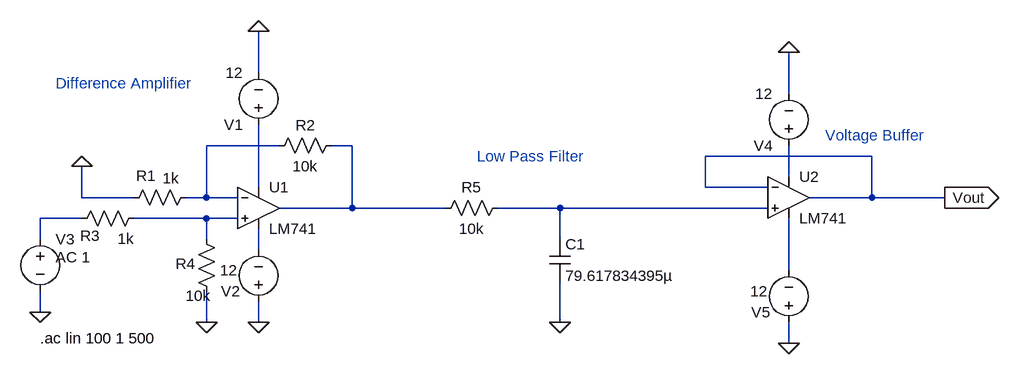
[diagram p0: schematic p3.asc]
p3.asc, the LTspice schematic file:
Version 4
SHEET 1 1376 680
WIRE 208 -32 208 -96
WIRE 1024 0 1024 -64
WIRE 240 80 128 80
WIRE 352 80 320 80
WIRE 1152 96 896 96
WIRE 1024 128 1024 80
WIRE 208 144 208 48
WIRE 896 144 896 96
WIRE 992 144 896 144
WIRE -64 160 -64 112
WIRE 16 160 -64 160
WIRE 128 160 128 80
WIRE 128 160 96 160
WIRE 176 160 128 160
WIRE 1152 160 1152 96
WIRE 1152 160 1056 160
WIRE 1264 160 1152 160
WIRE 352 176 352 80
WIRE 352 176 240 176
WIRE 496 176 352 176
WIRE 672 176 576 176
WIRE 992 176 672 176
WIRE -64 192 -128 192
WIRE 128 192 16 192
WIRE 176 192 128 192
WIRE -128 224 -128 192
WIRE 128 224 128 192
WIRE 672 224 672 176
WIRE 208 240 208 208
WIRE 1024 272 1024 192
WIRE -128 336 -128 304
WIRE 128 352 128 304
WIRE 208 352 208 320
WIRE 672 352 672 288
WIRE 1024 384 1024 352
FLAG 128 352 0
FLAG 208 352 0
FLAG 208 -96 0
FLAG -128 336 0
FLAG 672 352 0
FLAG 1024 -64 0
FLAG 1024 384 0
FLAG 1264 160 Vout
IOPIN 1264 160 Out
FLAG -64 112 0
SYMBOL OpAmps\\LM741 208 112 R0
SYMATTR InstName U1
SYMBOL res 336 64 R90
WINDOW 0 0 56 VBottom 2
WINDOW 3 32 56 VTop 2
SYMATTR InstName R2
SYMATTR Value 10k
SYMBOL res 112 144 R90
WINDOW 0 -2 77 VBottom 2
WINDOW 3 -29 39 VTop 2
SYMATTR InstName R1
SYMATTR Value 1k
SYMBOL res 32 176 R90
WINDOW 0 58 83 VBottom 2
WINDOW 3 32 28 VTop 2
SYMATTR InstName R3
SYMATTR Value 1k
SYMBOL res 112 208 R0
WINDOW 0 -32 54 Left 2
WINDOW 3 -16 103 Left 2
SYMATTR InstName R4
SYMATTR Value 10k
SYMBOL voltage 208 64 R180
WINDOW 123 0 0 Left 0
WINDOW 39 0 0 Left 0
SYMATTR InstName V1
SYMATTR Value 12
SYMBOL voltage 208 336 R180
WINDOW 0 28 32 Left 2
WINDOW 3 32 64 Left 2
WINDOW 123 0 0 Left 0
WINDOW 39 0 0 Left 0
SYMATTR InstName V2
SYMATTR Value 12
SYMBOL voltage -128 208 R0
WINDOW 123 24 44 Left 2
WINDOW 39 0 0 Left 0
SYMATTR Value2 AC 1
SYMATTR InstName V3
SYMATTR Value ""
SYMBOL res 592 160 R90
WINDOW 0 0 56 VBottom 2
WINDOW 3 32 56 VTop 2
SYMATTR InstName R5
SYMATTR Value 10k
SYMBOL cap 656 224 R0
SYMATTR InstName C1
SYMATTR Value 79.617834395µ
SYMBOL OpAmps\\LM741 1024 96 R0
SYMATTR InstName U2
SYMBOL voltage 1024 96 R180
WINDOW 123 0 0 Left 0
WINDOW 39 0 0 Left 0
SYMATTR InstName V4
SYMATTR Value 12
SYMBOL voltage 1024 368 R180
WINDOW 0 28 32 Left 2
WINDOW 3 32 64 Left 2
WINDOW 123 0 0 Left 0
WINDOW 39 0 0 Left 0
SYMATTR InstName V5
SYMATTR Value 12
TEXT -128 376 Left 2 !.ac lin 100 1 500
TEXT 544 96 Left 2 ;Low Pass Filter
TEXT -104 -16 Left 2 ;Difference Amplifier
TEXT 1080 64 Left 2 ;Voltage Buffer

The netlist it stands for:
* p3.asc
XU1 N007 N001 N004 N008 N002 LM741  ; pins In+ In- V+ V- OUT
R2 N002 N001 10k
R1 N001 0 1k
R3 N007 N006 1k
R4 N007 0 10k
V1 N004 0 12
V2 0 N008 12
V3 N006 0 AC 1
R5 N005 N002 10k
C1 N005 0 79.617834395µ
XU2 N005 Vout N003 N009 Vout LM741  ; pins In+ In- V+ V- OUT
V4 N003 0 12
V5 0 N009 12
.ac lin 100 1 500
* Low Pass Filter
* Difference Amplifier
* Voltage Buffer
.lib LM741.lib
.backanno
.end